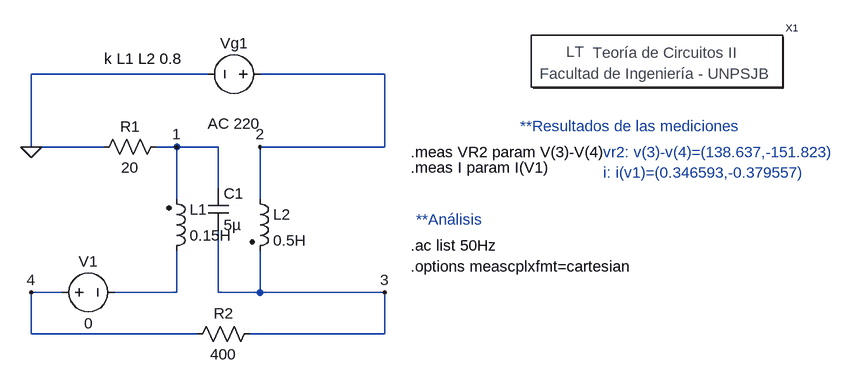
[diagram p0: schematic nodos_modificado4.asc]
nodos_modificado4.asc, the LTspice schematic file:
Version 4
SHEET 1 952 680
WIRE -16 0 -288 0
WIRE 256 0 64 0
WIRE -288 112 -288 0
WIRE -176 112 -288 112
WIRE -64 112 -96 112
WIRE 0 112 -64 112
WIRE 256 112 256 0
WIRE 256 112 64 112
WIRE 0 176 0 112
WIRE -64 192 -64 112
WIRE 64 192 64 112
WIRE -240 336 -288 336
WIRE -64 336 -64 272
WIRE -64 336 -160 336
WIRE 0 336 0 240
WIRE 64 336 64 272
WIRE 64 336 0 336
WIRE 256 336 64 336
WIRE -288 400 -288 336
WIRE -32 400 -288 400
WIRE 256 400 256 336
WIRE 256 400 48 400
FLAG -64 112 1
FLAG 64 112 2
FLAG 256 336 3
FLAG -288 336 4
FLAG -288 112 0
SYMBOL res -80 96 R90
WINDOW 0 0 56 VBottom 2
WINDOW 3 32 56 VTop 2
SYMATTR InstName R1
SYMATTR Value 20
SYMBOL ind2 -80 288 M180
WINDOW 0 36 80 Left 2
WINDOW 3 36 40 Left 2
SYMATTR InstName L1
SYMATTR Value 0.15H
SYMATTR Type ind
SYMBOL ind2 48 176 R0
SYMATTR InstName L2
SYMATTR Value 0.5H
SYMATTR Type ind
SYMBOL Circuitos2\\Letreros\\Teoría\ de\ Circuitos\ II 672 -16 R0
SYMATTR InstName X1
SYMBOL voltage 80 0 R90
WINDOW 0 -32 56 VBottom 2
WINDOW 3 32 56 VTop 2
WINDOW 123 60 56 VTop 2
WINDOW 39 0 0 Left 0
SYMATTR InstName Vg1
SYMATTR Value ""
SYMATTR Value2 AC 220
SYMBOL res 64 384 R90
WINDOW 0 0 56 VBottom 2
WINDOW 3 32 56 VTop 2
SYMATTR InstName R2
SYMATTR Value 400
SYMBOL cap -16 176 R0
SYMATTR InstName C1
SYMATTR Value 5µ
SYMBOL voltage -256 336 R270
WINDOW 0 32 56 VTop 2
WINDOW 3 -32 56 VBottom 2
WINDOW 123 0 0 Left 0
WINDOW 39 0 0 Left 0
SYMATTR InstName V1
SYMATTR Value 0
TEXT 304 224 Left 2 ;**Análisis
TEXT 296 264 Left 2 !.ac list 50Hz
TEXT 296 296 Left 2 !.options meascplxfmt=cartesian
TEXT 464 80 Left 2 ;**Resultados de las mediciones
TEXT 296 120 Left 2 !.meas VR2 param V(3)-V(4)
TEXT -176 -24 Left 2 !k L1 L2 0.8
TEXT 296 144 Left 2 !.meas I param I(V1)
TEXT 592 120 Left 2 ;vr2: v(3)-v(4)=(138.637,-151.823)\ni: i(v1)=(0.346593,-0.379557)

The netlist it stands for:
* nodos_modificado4.asc
R1 1 0 20
L1 N001 1 0.15H
L2 2 3 0.5H
XX1 Teoría de Circuitos II
Vg1 2 0 AC 220
R2 3 4 400
C1 1 3 5µ
V1 4 N001 0
* **Análisis
.ac list 50Hz
.options meascplxfmt=cartesian
* **Resultados de las mediciones
.meas VR2 param V(3)-V(4)
k L1 L2 0.8
.meas I param I(V1)
* vr2: v(3)-v(4)=(138.637,-151.823)
* i: i(v1)=(0.346593,-0.379557)
.backanno
.end